# EasyEDA schematic 1-Schematic_PI Temp Sens.json
TITLE: Temp Sensor; REV: 1.0; Date: 2019-09-30; Sheet: 1/1; Drawn By: extra.alexgthomp; Company: Your Company
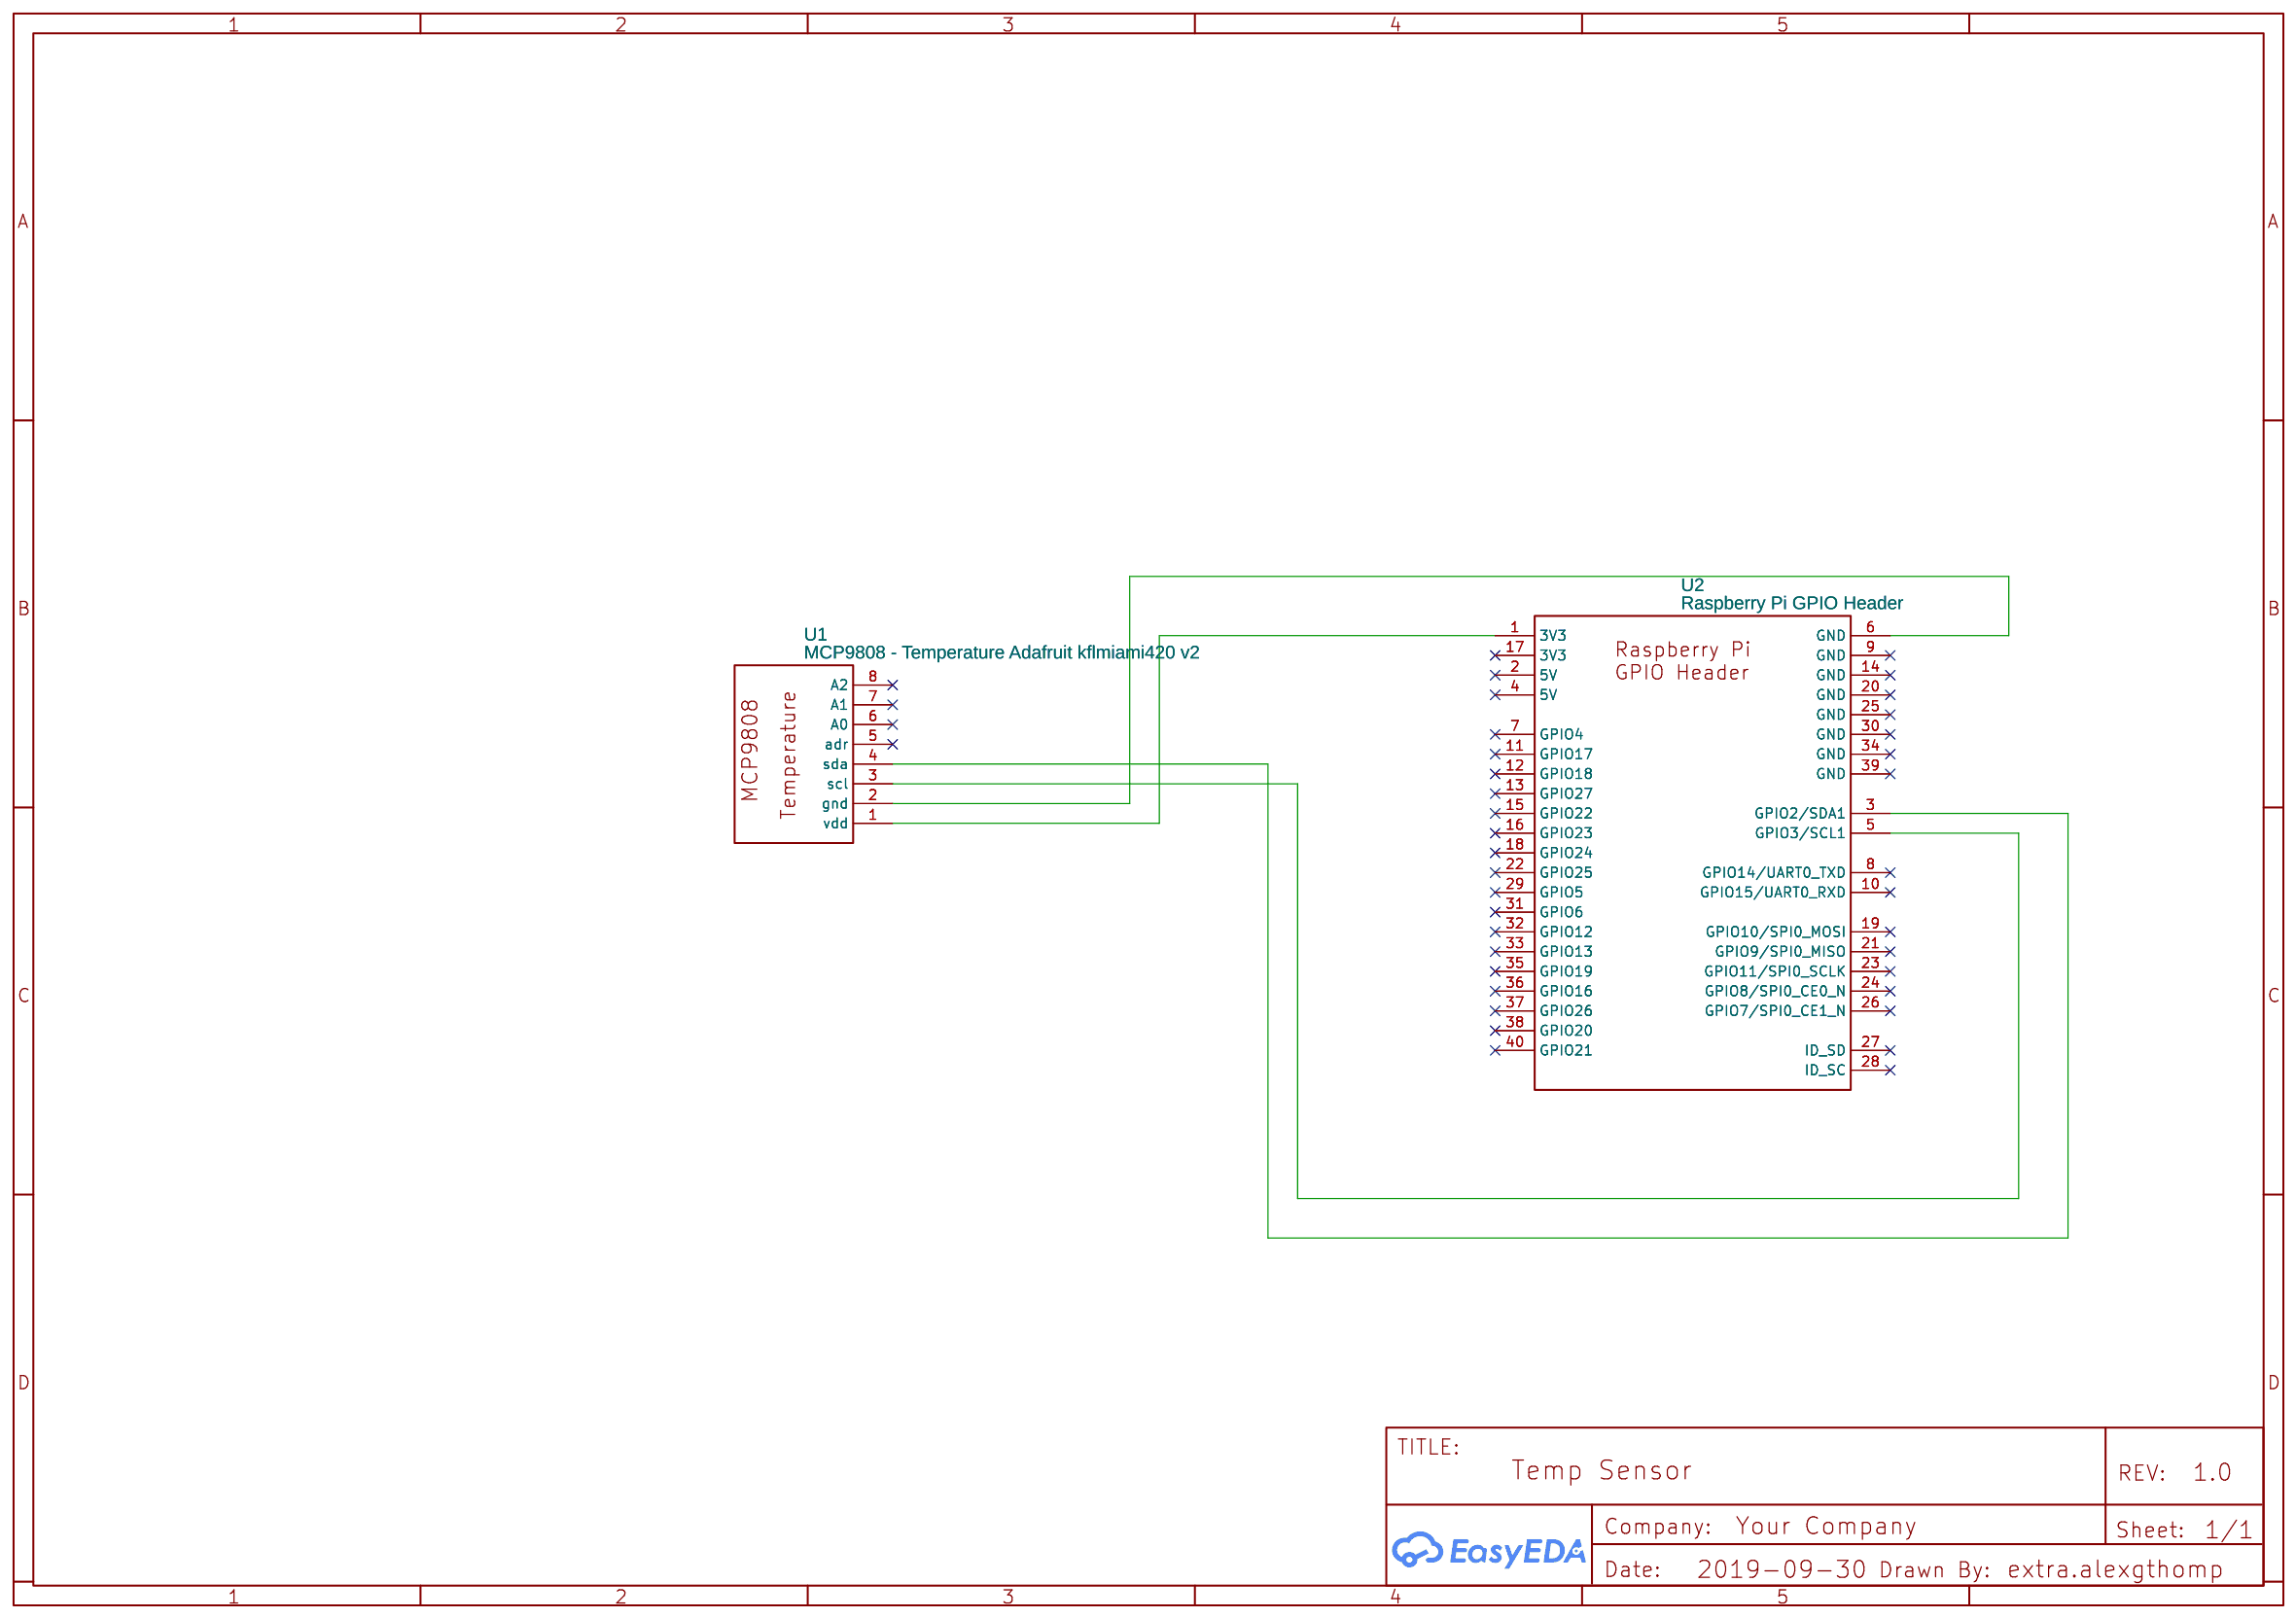
[diagram p0: schematic sheet]

## Parts
#1  -
U1  MCP9808 - Temperature Adafruit kflmiami420 v2  [ADAFRUIT MCP9898 TEMP I2C SENSOR PCB LIB FOR KFLMIAMI420 V1]
U2  Raspberry Pi GPIO Header  [RASPBERRY_PI_GPIO_HEADER]

## Library data of the parts
#1 = -: BOM_Manufacturer Part: ?
U1 = -: Manufacturer: Adafruit; Manufacturer Part: Adafruit; Supplier Part: 1782; Supplier: Adafruit; link: https://www.adafruit.com/product/1782; Contributor: Andre C
U2 = -: Supplier Part: undefined; Contributor: LucAce

## Nets
Net-(U1-1): U1.1(vdd) U2.1(3V3)
Net-(U1-2): U1.2(gnd) U2.6(GND)
Net-(U1-3): U1.3(scl) U2.5(GPIO3/SCL1)
Net-(U1-4): U1.4(sda) U2.3(GPIO2/SDA1)

Not connected (* = marked no-connect by the designer): U1 5(adr)* 6(A0)* 7(A1)* 8(A2)*; U2 2(5V)* 4(5V)* 7(GPIO4)* 8(GPIO14/UART0_TXD)* 9(GND)* 10(GPIO15/UART0_RXD)* 11(GPIO17)* 12(GPIO18)* 13(GPIO27)* 14(GND)* 15(GPIO22)* 16(GPIO23)* 17(3V3)* 18(GPIO24)* 19(GPIO10/SPI0_MOSI)* 20(GND)* 21(GPIO9/SPI0_MISO)* 22(GPIO25)* 23(GPIO11/SPI0_SCLK)* 24(GPIO8/SPI0_CE0_N)* 25(GND)* 26(GPIO7/SPI0_CE1_N)* 27(ID_SD)* 28(ID_SC)* 29(GPIO5)* 30(GND)* 31(GPIO6)* 32(GPIO12)* 33(GPIO13)* 34(GND)* 35(GPIO19)* 36(GPIO16)* 37(GPIO26)* 38(GPIO20)* 39(GND)* 40(GPIO21)*
